# EAGLE design main (EAGLE 8.4.0)
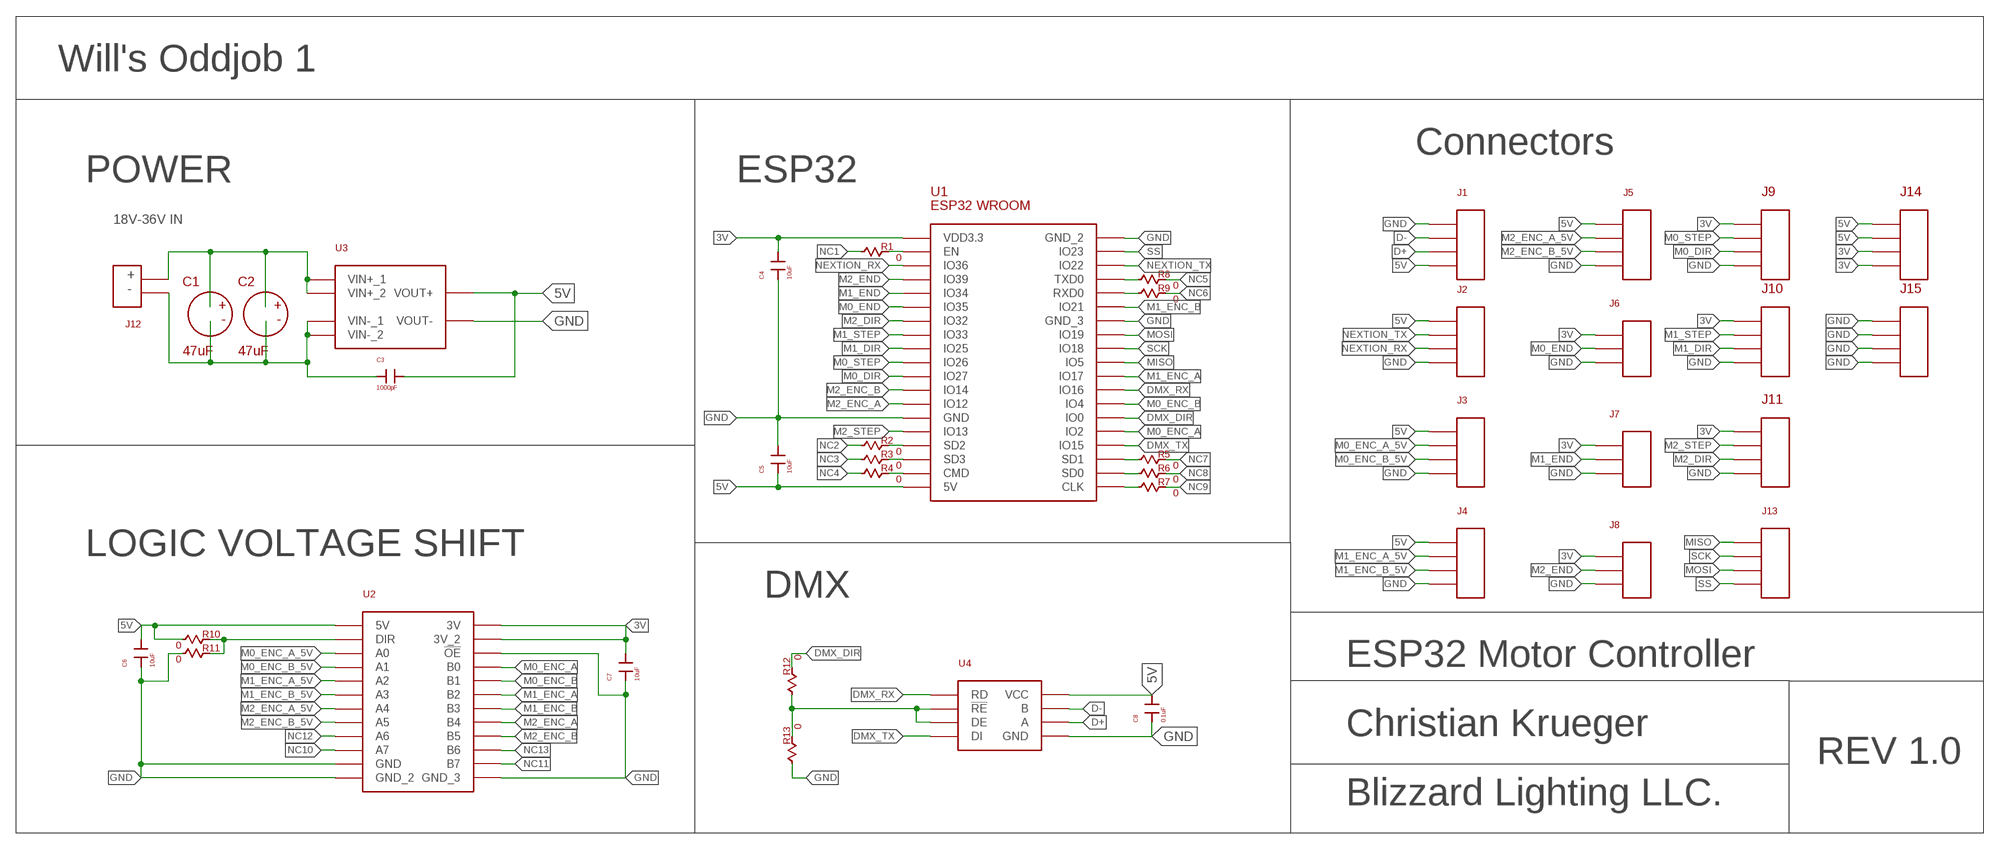
[diagram p0: schematic, sheet 1]

## Parts
C1  47uF  TH_CAP_DEV  [TH_CAP_PKG]
C2  47uF  TH_CAP_DEV  [TH_CAP_PKG]
C3  1000pF  1808_CAP_DEV  [1808_PKG]
C4  10uF  0805_CAP_DEV  [0805_PKG]
C5  10uF  0805_CAP_DEV  [0805_PKG]
C6  10uF  0805_CAP_DEV  [0805_PKG]
C7  10uF  0805_CAP_DEV  [0805_PKG]
C8  0.1uF  0805_CAP_DEV  [0805_PKG]
J1  XH_4POS_DEV  [XH_4POS_PKG]
J2  XH_4POS_DEV  [XH_4POS_PKG]
J3  XH_4POS_DEV  [XH_4POS_PKG]
J4  XH_4POS_DEV  [XH_4POS_PKG]
J5  XH_4POS_DEV  [XH_4POS_PKG]
J6  XH_3POS_DEV  [XH_3POS_PKG]
J7  XH_3POS_DEV  [XH_3POS_PKG]
J8  XH_3POS_DEV  [XH_3POS_PKG]
J9  4_PIN_SCREW_3.5MM_DEV  [4_PIN_SCREW_3.5MM_PKG]
J10  4_PIN_SCREW_3.5MM_DEV  [4_PIN_SCREW_3.5MM_PKG]
J11  4_PIN_SCREW_3.5MM_DEV  [4_PIN_SCREW_3.5MM_PKG]
J12  2_PIN_SCREW_3.5MM_DEV  [2_PIN_SCREW_3.5MM_PKG]
J13  4_PIN_2.54MM_PKG  [4_PIN_2.54MM_PKG]
J14  4_PIN_SCREW_3.5MM_DEV  [4_PIN_SCREW_3.5MM_PKG]
J15  4_PIN_SCREW_3.5MM_DEV  [4_PIN_SCREW_3.5MM_PKG]
R1  0  0805_RES_DEV  [0805_PKG]
R2  0  0805_RES_DEV  [0805_PKG]
R3  0  0805_RES_DEV  [0805_PKG]
R4  0  0805_RES_DEV  [0805_PKG]
R5  0  0805_RES_DEV  [0805_PKG]
R6  0  0805_RES_DEV  [0805_PKG]
R7  0  0805_RES_DEV  [0805_PKG]
R8  0  0805_RES_DEV  [0805_PKG]
R9  0  0805_RES_DEV  [0805_PKG]
R10  0  0805_RES_DEV  [0805_PKG]
R11  0  0805_RES_DEV  [0805_PKG]
R12  0  0805_RES_DEV  [0805_PKG]
R13  0  0805_RES_DEV  [0805_PKG]
U1  ESP32_WROOM_BREAKOUT_DEV  [ESP_WROOM_BREAKOUT_PKG]
U2  8_CHANNEL_LEVEL_SHIFTER  [8_LEVEL_SHIFTER_PKG]
U3  5V_SWITCHING_POWER_DEV  [5V_SWITCHING_POWER_PKG]
U4  MAX_485_DEV  [MAX_485_PKG]

## Nets
3V: C4.P$2 C7.P$2 J6.P$1 J7.P$1 J8.P$1 J9.1 J10.1 J11.1 J14.3 J14.4 U1.VDD3.3 U2.3V U2.3V_2
5V: C3.P$2 C5.P$1 C6.P$2 C8.P$2 J1.P$4 J2.P$1 J3.P$1 J4.P$1 J5.P$1 J14.1 J14.2 R10.P$1 U1.5V U2.5V U3.VOUT+ U4.P$8(VCC)
D+: J1.P$3 U4.P$6(A)
D-: J1.P$2 U4.P$7(B)
DMX_DIR: R12.P$2 U1.IO0
DMX_RX: U1.IO16 U4.P$1(RD)
DMX_TX: U1.IO15 U4.P$4(DI)
GND: C4.P$1 C5.P$2 C6.P$1 C7.P$1 C8.P$1 J1.P$1 J2.P$4 J3.P$4 J4.P$4 J5.P$4 J6.P$3 J7.P$3 J8.P$3 J9.4 J10.4 J11.4 J15.1 J15.2 J15.3 J15.4 R11.P$1 R13.P$1 U1.GND U1.GND_2 U1.GND_3 U2.!OE U2.GND U2.GND_2 U2.GND_3 U3.VOUT- U4.P$5(GND)
M0_DIR: J9.3 U1.IO27
M0_ENC_A: U1.IO2 U2.B0
M0_ENC_A_5V: J3.P$2 U2.A0
M0_ENC_B: U1.IO4 U2.B1
M0_ENC_B_5V: J3.P$3 U2.A1
M0_END: J6.P$2 U1.IO35
M0_STEP: J9.2 U1.IO26
M1_DIR: J10.3 U1.IO25
M1_ENC_A: U1.IO17 U2.B2
M1_ENC_A_5V: J4.P$2 U2.A2
M1_ENC_B: U1.IO21 U2.B3
M1_ENC_B_5V: J4.P$3 U2.A3
M1_END: J7.P$2 U1.IO34
M1_STEP: J10.2 U1.IO33
M2_DIR: J11.3 U1.IO32
M2_ENC_A: U1.IO12 U2.B4
M2_ENC_A_5V: J5.P$2 U2.A4
M2_ENC_B: U1.IO14 U2.B5
M2_ENC_B_5V: J5.P$3 U2.A5
M2_END: J8.P$2 U1.IO39
M2_STEP: J11.2 U1.IO13
MISO: J13.1 U1.IO5
MOSI: J13.3 U1.IO19
N$1: C1.P$1 C2.P$1 J12.P$2 U3.VIN+_1 U3.VIN+_2
N$2: C1.P$2 C2.P$2 C3.P$1 J12.P$1 U3.VIN-_1 U3.VIN-_2
N$3: R1.P$2 U1.EN
N$4: R12.P$1 R13.P$2 U4.P$2(!RE) U4.P$3(DE)
N$5: R2.P$2 U1.SD2
N$6: R3.P$2 U1.SD3
N$7: R4.P$2 U1.CMD
N$9: R10.P$2 R11.P$2 U2.DIR
N$11: R7.P$1 U1.CLK
N$12: R6.P$1 U1.SD0
N$13: R5.P$1 U1.SD1
N$17: R8.P$1 U1.TXD0
N$18: R9.P$1 U1.RXD0
NC1: R1.P$1
NC2: R2.P$1
NC3: R3.P$1
NC4: R4.P$1
NC5: R8.P$2
NC6: R9.P$2
NC7: R5.P$2
NC8: R6.P$2
NC9: R7.P$2
NC10: U2.A7
NC11: U2.B7
NC12: U2.A6
NC13: U2.B6
NEXTION_RX: J2.P$3 U1.IO36
NEXTION_TX: J2.P$2 U1.IO22
SCK: J13.2 U1.IO18
SS: J13.4 U1.IO23

## Notes on the sheet
- Will's Oddjob 1
- Connectors
- POWER | ESP32
- 18V-36V IN
- +
- -
- LOGIC VOLTAGE SHIFT
- DMX
- ESP32 Motor Controller
- Christian Krueger
- REV 1.0
- Blizzard Lighting LLC.

## Library data of the parts
C1 C2 = blizzard_common_1:TH_CAP_DEV
C3 = blizzard_common_1:1808_CAP_DEV
C4-C8 = blizzard_common_1:0805_CAP_DEV
J1-J5 = blizzard_common_1:XH_4POS_DEV
J6-J8 = blizzard_common_1:XH_3POS_DEV
J9-J11 J14 J15 = blizzard_common_0:4_PIN_SCREW_3.5MM_DEV
J12 = blizzard_common_0:2_PIN_SCREW_3.5MM_DEV
J13 = blizzard_common_0:4_PIN_2.54MM_PKG
R1-R13 = blizzard_common_1:0805_RES_DEV
U1 = blizzard_common_0:ESP32_WROOM_BREAKOUT_DEV: ESP32 WROOM Breakout
U2 = blizzard_common_0:8_CHANNEL_LEVEL_SHIFTER
U3 = blizzard_common_0:5V_SWITCHING_POWER_DEV
U4 = blizzard_board:MAX_485_DEV: MAX 485

## Board
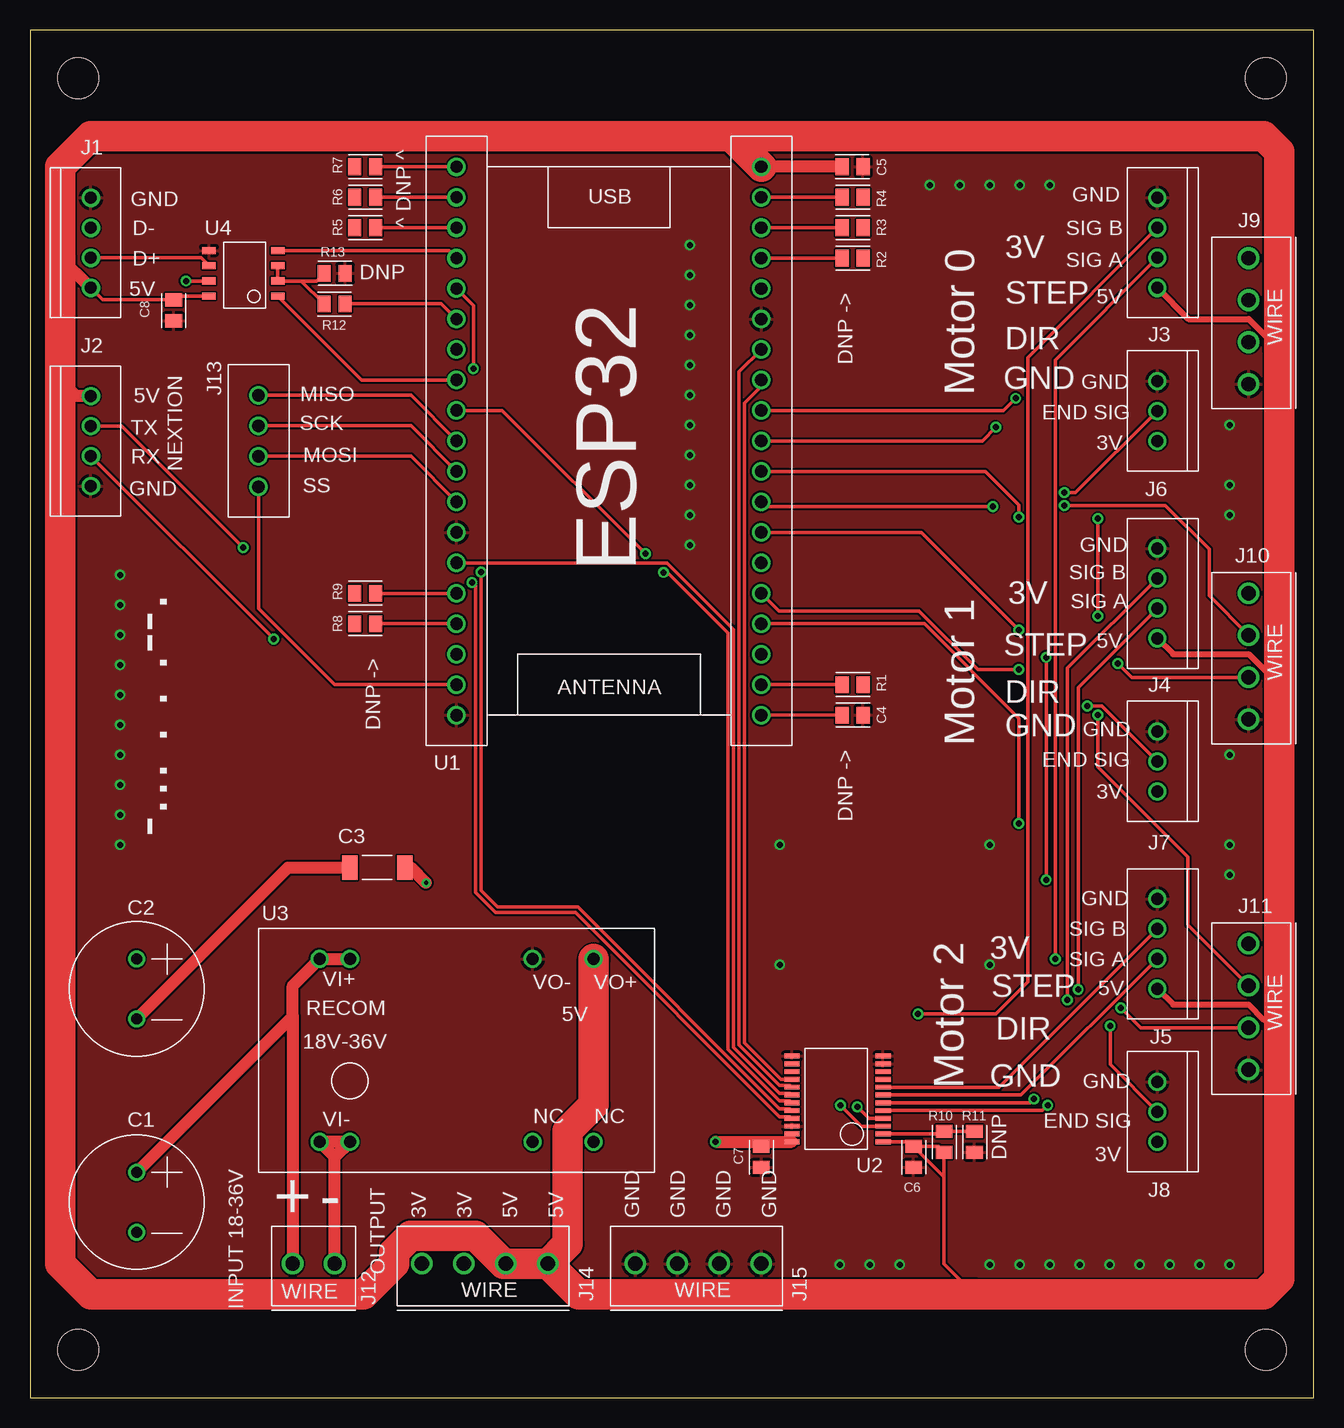
[diagram p1: board, top side]
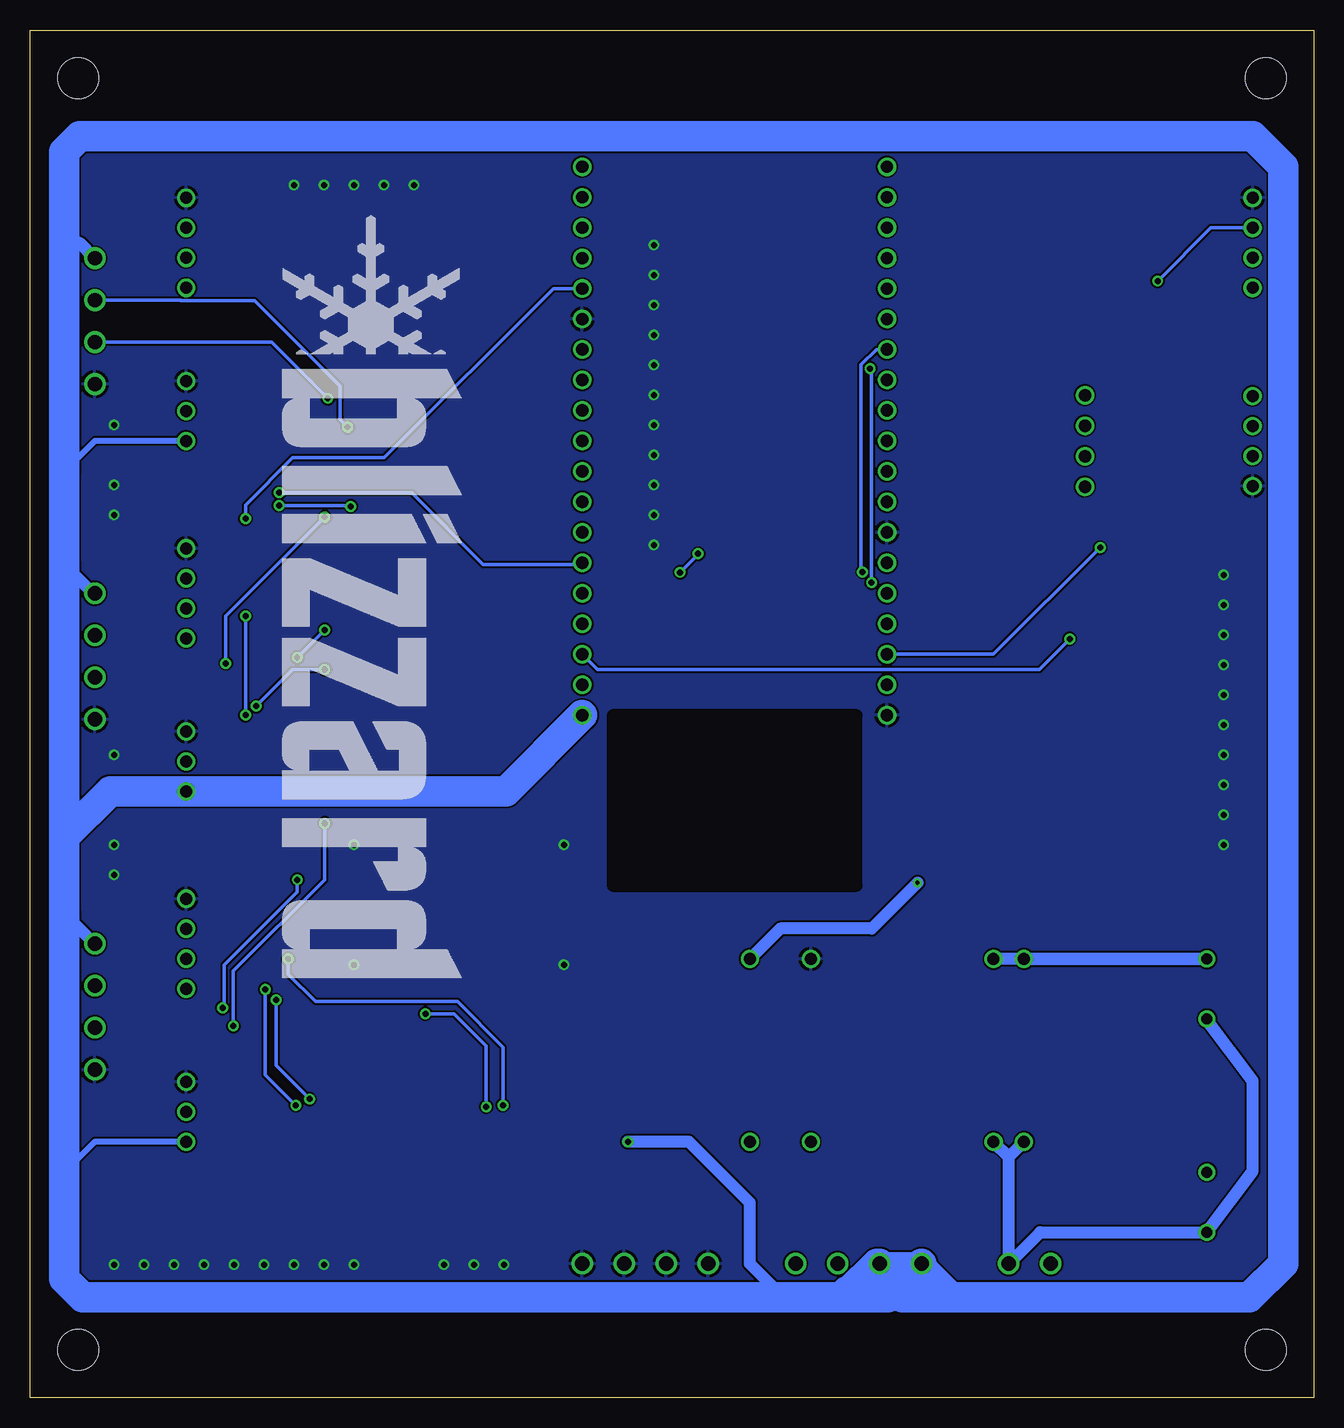
[diagram p2: board, bottom side, seen from below]

Size 107 x 114 mm. Coordinates in mm from the lower left corner, seen from the top.
Outline: 0,0 107,0 107,114 0,114 0,0
Copper layers (1*16): Top 0.035mm / dielectric 1.5mm / Bottom 0.035mm
Design rules "default": minimum track width 6mil, minimum drill 0.35mm, track to track 6mil, track to pad 6mil, pad to pad 6mil, via to via 6mil, smd to smd 6mil, copper to edge 40mil, drill to drill 6mil, minimum pad ring 10mil, minimum via ring 8mil, stop-mask expansion 4mil, vias tented up to drill 0mil, thermal gap 10mil
Holes 3.4 mm at 4,4 103,4 103,110 4,110

### Footprints (pad centres in the part's own frame; a part is rotated, then mirrored left to right if it is on the bottom)
TH_CAP_PKG = drill 0.9: P$1 0,0; P$2 0,-5
1808_PKG = smd 1.3 x 2.05: P$1 0,0; P$2 4.57,0
0805_PKG = smd 1.1 x 1.4: P$1 -0.875,0; P$2 0.875,0
XH_4POS_PKG = drill 1: P$1 -3.75,0; P$2 -1.25,0; P$3 1.25,0; P$4 3.75,0
XH_3POS_PKG = drill 1: P$1 0,0; P$2 2.5,0; P$3 5,0
4_PIN_SCREW_3.5MM_PKG = drill 1.2: 1 0,0; 2 3.5,0; 3 7,0; 4 10.5,0
2_PIN_SCREW_3.5MM_PKG = drill 1.2: P$1 0,0; P$2 3.5,0
4_PIN_2.54MM_PKG = drill 1.03: 1 0,0; 2 2.54,0; 3 5.08,0; 4 7.62,0
ESP_WROOM_BREAKOUT_PKG = drill 1.03: 5V 0,-45.72; CLK 25.4,-45.72; CMD 0,-43.18; EN 0,-2.54; GND 0,-33.02; GND_2 25.4,0; GND_3 25.4,-15.24; IO0 25.4,-33.02; IO2 25.4,-35.56; IO4 25.4,-30.48; IO5 25.4,-22.86; IO12 0,-30.48; IO13 0,-35.56; IO14 0,-27.94; IO15 25.4,-38.1; IO16 25.4,-27.94; IO17 25.4,-25.4; IO18 25.4,-20.32; IO19 25.4,-17.78; IO21 25.4,-12.7; IO22 25.4,-5.08; IO23 25.4,-2.54; IO25 0,-20.32; IO26 0,-22.86; IO27 0,-25.4; IO32 0,-15.24; IO33 0,-17.78; IO34 0,-10.16; IO35 0,-12.7; IO36 0,-5.08; IO39 0,-7.62; RXD0 25.4,-10.16; SD0 25.4,-43.18; SD1 25.4,-40.64; SD2 0,-38.1; SD3 0,-40.64; TXD0 25.4,-7.62; VDD3.3 0,0
8_LEVEL_SHIFTER_PKG = smd 1.27 x 0.4: 3V 7.6,0; 3V_2 7.6,-0.65; 5V 0,0; !OE 7.6,-1.3; A0 0,-1.3; A1 0,-1.95; A2 0,-2.6; A3 0,-3.25; A4 0,-3.9; A5 0,-4.55; A6 0,-5.2; A7 0,-5.85; B0 7.6,-1.95; B1 7.6,-2.6; B2 7.6,-3.25; B3 7.6,-3.9; B4 7.6,-4.55; B5 7.6,-5.2; B6 7.6,-5.85; B7 7.6,-6.5; DIR 0,-0.65; GND 0,-6.5; GND_2 0,-7.15; GND_3 7.6,-7.15
5V_SWITCHING_POWER_PKG = drill 1: NC_1 17.78,-15.24; NC_2 22.86,-15.24; VIN+_1 0,0; VIN+_2 2.54,0; VIN-_1 0,-15.24; VIN-_2 2.54,-15.24; VOUT+ 22.86,0; VOUT- 17.78,0
MAX_485_PKG = smd 0.6 x 1.15: P$1 -1.905,-2.883; P$2 -0.635,-2.883; P$3 0.635,-2.883; P$4 1.905,-2.883; P$5 1.905,2.857; P$6 0.635,2.857; P$7 -0.635,2.857; P$8 -1.905,2.857

### Placement (x,y rotation side)
C1  8.89,18.78 0 top
C2  8.89,36.56 0 top
C3  26.67,44.18 0 top
C4  68.58,56.88 180 top
C5  68.58,102.6 0 top
C6  73.66,20.05 90 top
C7  60.96,20.05 90 top
C8  11.97,90.63 90 top
J1  5.08,96.25 270 top
J2  5.08,79.74 270 top
J3  93.98,96.25 90 top
J4  93.98,67.04 90 top
J5  93.98,37.83 90 top
J6  93.98,79.74 90 top
J7  93.98,50.53 90 top
J8  93.98,21.32 90 top
J9  101.6,94.98 270 top
J10  101.6,67.04 270 top
J11  101.6,37.83 270 top
J12  25.4,11.16 180 top
J13  19.05,83.55 270 top
J14  43.18,11.16 180 top
J15  60.96,11.16 180 top
R1  68.58,59.42 180 top
R2  68.58,94.98 180 top
R3  68.58,97.52 180 top
R4  68.58,100.06 180 top
R5  27.94,97.52 180 top
R6  27.94,100.06 180 top
R7  27.94,102.6 180 top
R8  27.94,64.5 180 top
R9  27.94,67.04 180 top
R10  76.2,21.32 90 top
R11  78.74,21.32 90 top
R12  25.4,91.17 0 top
R13  25.4,93.71 180 top
U1  60.96,56.88 180 top
U2  71.12,21.32 180 top
U3  24.13,36.56 0 top
U4  17.78,93.71 90 top

### Tracks (layer width: path | path; a pad name or v marks a point on that pad's centre or on a via)
3V  (via drill 0.5)
  Top 0.305: U2.3V_2 U2.3V 63.12,20.93 C7.P$2 | C4.P$2 U1.VDD3.3
  Top 1.016: v57.15,21.32 U2.3V
  Bottom 0.508: J6.P$1 101.6,79.74 104.14,77.2 | J7.P$1 101.6,50.53 104.14,47.99 104.14,46.72 | J8.P$1 101.6,21.32 104.14,18.78 104.14,17.51
  Bottom 1.016: J14.3 36.51,10.84 38.72,8.62 44.45,8.62 46.99,11.16 46.99,16.24 52.07,21.32 v57.15,21.32 | J9.1 102.87,96.25 104.14,96.25 | J11.1 104.14,40.37 | J10.1 101.73,67.04 104.14,69.45
  Bottom 2.54: J14.4 33.01,10.84 36.51,10.84 | J14.4 35.47,8.37 39.37,8.37 | 39.37,8.37 102.62,8.37 104.14,9.89 104.14,17.51 104.14,40.37 104.14,46.72 | 104.14,46.72 104.14,69.45 104.14,77.2 104.14,96.25 104.14,103.87 102.87,105.14 5.08,105.14 2.54,102.6 2.54,11.16 5.33,8.37 34.29,8.37 | J14.4 32.68,10.82 30.48,8.62 33.64,8.62 J14.3 36.4,11.16 38.72,8.84 38.9,8.84 39.37,8.37 | U1.VDD3.3 67.31,50.53 100.33,50.53 104.14,46.72
5V  (via drill 0.35)
  Top 0.305: U4.P$8 12.27,91.81 C8.P$2 6.08,91.51 J1.P$4 | U2.5V 73.27,21.32 C6.P$2 | C6.P$2 75.72,20.93 R10.P$1 76.2,18.39 | C6.P$2 76.2,18.39 | 76.2,18.39 76.2,11.16 78.74,8.62
  Top 0.508: J5.P$1 95.31,32.75 101.6,32.75 102.87,31.48 104.14,31.48 | J4.P$1 95.31,61.96 101.6,61.96 104.14,59.42 | J3.P$1 96.58,89.9 101.6,89.9 104.14,87.36
  Top 1.016: v33.02,42.91 31.75,44.18 C3.P$2 | C5.P$1 U1.5V | J2.P$1 3.87,83.49 2.54,84.82 | J1.P$4 5.02,92.5 2.54,94.98
  Top 2.54: J14.1 J14.2 39.46,11.16 37.14,13.48 31.72,13.48 30.36,12.12 30.36,11.16 27.82,8.62 5.08,8.62 2.54,11.16 2.54,84.82 2.54,94.98 2.54,102.6 5.08,105.14 58.42,105.14 | 58.42,105.14 102.87,105.14 104.14,103.87 104.14,87.36 104.14,59.42 104.14,31.48 104.14,9.89 102.87,8.62 78.74,8.62 45.72,8.62 J14.1 | J14.1 44.81,12.79 44.81,22.22 46.99,24.4 U3.VOUT+ | U1.5V 58.42,105.14
  Bottom 1.016: U3.VOUT+ 44.45,39.1 36.83,39.1 v33.02,42.91
D+
  Top 0.305: U4.P$6 14.27,95 J1.P$3
D-  (via drill 0.5)
  Top 0.305: U4.P$7 v13,93.08
  Bottom 0.305: v13,93.08 8.58,97.5 J1.P$2
DMX_DIR
  Top 0.305: R12.P$2 34.29,91.17 U1.IO0
DMX_RX
  Top 0.305: U4.P$1 27.65,84.82 U1.IO16
DMX_TX
  Top 0.305: U4.P$4 34.92,95.62 U1.IO15
GND  (via drill 0.5)
  other vias: 7.5,46.08 7.5,48.58 7.5,51.08 7.5,53.58 7.5,56.08 7.5,58.58 7.5,61.08 7.5,63.58 7.5,66.08 7.5,68.58 55,96.08 55,93.58 55,91.08 55,88.58 55,86.08 55,83.58 55,81.08 55,78.58 55,76.08 55,73.58 55,71.08 75,101.08 77.5,101.08 80,101.08 82.5,101.08 85,101.08 100,11.08 97.5,11.08 95,11.08 92.5,11.08 90,11.08 87.5,11.08 85,11.08 82.5,11.08 80,11.08 72.5,11.08 70,11.08 67.5,11.08 100,73.58 100,76.08 100,81.08 100,53.58 100,46.08 100,43.58 62.5,46.08 80,46.08 80,36.08 62.5,36.08
  pour Top: 0,0 0.23,104.4 113.26,104.4 113.03,81.28 113.03,0
  pour Bottom: 0,0 108.5,-1.19 108.5,99.14 106.92,104.79 0.44,104.22
  cutout Top: 38.1,56.88 58.42,56.88 58.42,42.66 38.1,42.66
  cutout Bottom: 38.1,56.88 58.42,56.88 58.42,42.66 38.1,42.66
M0_DIR  (via drill 0.5)
  Top 0.305: U1.IO27 81.15,82.28 v82.17,83.3
  Bottom 0.305: v82.17,83.3 86.85,87.98 J9.3
M0_ENC_A  (via drill 0.5)
  Top 0.305: U2.B0 63.38,23.42 62.49,23.42 45.48,40.42 38.8,40.42 37.13,42.09 37.13,67.63 v36.83,67.93 | v36.96,85.78 36.96,91.04 U1.IO2
  Bottom 0.305: v36.83,67.93 36.83,85.65 v36.96,85.78
M0_ENC_A_5V  (via drill 0.5)
  Top 0.305: U2.A0 69.31,22.62 v67.56,24.37 | v85.47,36.56 85.47,86.49 J3.P$2
  Bottom 0.305: v67.56,24.37 67.56,29.2 71.37,33.01 83.19,33.01 85.47,35.29 v85.47,36.56
M0_ENC_B  (via drill 0.5)
  Top 0.305: U2.B1 63.38,24.07 62.49,24.07 45.67,40.88 38.99,40.88 37.59,42.28 v37.59,68.82
  Bottom 0.305: v37.59,68.82 37.72,68.95 37.72,86.09 36.45,87.36 U1.IO4
M0_ENC_B_5V  (via drill 0.5)
  Top 0.305: U2.A1 69.93,23.27 v68.96,24.24 | v74.04,31.99 80.52,31.99 83.19,34.66 83.19,86.71 J3.P$3
  Bottom 0.305: v68.96,24.24 68.96,29.32 71.63,31.99 v74.04,31.99
M0_END  (via drill 0.5)
  Top 0.305: J6.P$2 87.16,75.42 v86.23,75.42
  Bottom 0.305: U1.IO35 61.09,69.45 69.22,69.45 75.18,75.42 v86.23,75.42
M0_STEP  (via drill 0.5)
  Top 0.305: U1.IO26 79.38,79.74 v80.52,80.88
  Bottom 0.305: v80.52,80.88 81.15,81.52 81.15,84.31 88.28,91.44 94.42,91.44 94.46,91.48 J9.2
M1_DIR  (via drill 0.5)
  Top 0.305: J10.3 91.84,60.04 v90.68,61.2 | v82.43,73.39 82.43,74.4 79.63,77.2 U1.IO25
  Bottom 0.305: v90.68,61.2 90.68,65.14 v82.43,73.39
M1_ENC_A  (via drill 0.5)
  Top 0.305: U2.B2 63.38,24.72 62.48,24.72 58.19,29.01 58.19,63.74 53.14,68.79 v52.8,68.79 | v51.31,70.34 39.37,82.28 U1.IO17
  Bottom 0.305: v52.8,68.79 51.31,70.29 v51.31,70.34
M1_ENC_A_5V  (via drill 0.5)
  Top 0.305: U2.A2 84.39,23.92 v84.84,24.37 | v87.38,34.02 87.38,59.19 J4.P$2
  Bottom 0.305: v84.84,24.37 87.38,26.91 v87.38,34.02
M1_ENC_B
  Top 0.305: U2.B3 63.38,25.37 62.48,25.37 58.65,29.2 58.65,64.02 53.09,69.58 U1.IO21
M1_ENC_B_5V  (via drill 0.5)
  Top 0.305: U2.A3 83.39,24.57 v83.69,24.88 | v86.49,33.13 86.49,60.8 J4.P$3
  Bottom 0.305: v83.69,24.88 86.49,27.67 v86.49,33.13
M1_END  (via drill 0.5)
  Top 0.305: J7.P$2 89.37,57.64 v88.14,57.64 | v82.43,60.69 79.01,60.69 74.12,65.58 62.42,65.58 U1.IO34
  Bottom 0.305: v88.14,57.64 85.09,60.69 v82.43,60.69
M1_STEP  (via drill 0.5)
  Top 0.305: J10.2 98.3,66.84 98.3,70.72 94.66,74.36 v86.23,74.36 | v80.26,74.28 61.34,74.28 U1.IO33
  Bottom 0.305: v86.23,74.36 80.35,74.36 v80.26,74.28
M2_DIR  (via drill 0.5)
  Top 0.305: J11.3 92.6,30.83 v90.95,32.48 | v84.71,43.16 v84.71,61.71 | v82.43,63.99 74.3,72.12 U1.IO32
  Bottom 0.305: v90.95,32.48 90.81,32.62 90.81,36.05 84.71,42.15 v84.71,43.16 | v84.71,61.71 v82.43,63.99
M2_ENC_A
  Top 0.305: U2.B4 63.38,26.02 62.48,26.02 59.11,29.39 59.11,85.51 U1.IO12
M2_ENC_A_5V
  Top 0.305: U2.A4 82.62,25.22 J5.P$2
M2_ENC_B
  Top 0.305: U2.B5 62.62,26.52 59.56,29.58 59.56,82.92 60.96,84.31 U1.IO14
M2_ENC_B_5V
  Top 0.305: U2.A5 80.77,25.87 J5.P$3
M2_END  (via drill 0.5)
  Top 0.305: J8.P$2 90.04,27.76 v90.04,30.97 | v82.43,47.86 82.43,56.62 74.55,64.5 U1.IO39
  Bottom 0.305: v90.04,30.97 90.04,35.55 82.43,43.16 v82.43,47.86
M2_STEP  (via drill 0.5)
  Top 0.305: J11.2 96.52,39.41 96.52,45.07 89.03,52.56 v89.03,56.88 | v89.03,65.14 v89.03,73.26
  Bottom 0.305: v89.03,56.88 v89.03,65.14 | v89.03,73.26 89.03,74.41 85.09,78.34 77.47,78.34 63.37,92.44 U1.IO13
MISO
  Top 0.305: J13.1 31.75,83.55 U1.IO5
MOSI
  Top 0.305: J13.3 31.75,78.47 U1.IO19
N$1
  Top 1.016: 21.9,31.79 J12.P$2 | U3.VIN+_2 U3.VIN+_1 21.9,34.33 21.9,31.79 | C1.P$1 21.9,31.79
  Bottom 1.016: U3.VIN+_1 C2.P$1 U3.VIN+_2
N$2
  Top 1.016: 25.4,20.05 U3.VIN-_1 U3.VIN-_2 25.4,20.05 | J12.P$1 25.4,20.05 | C2.P$2 21.51,44.18 C3.P$1
  Bottom 1.016: U3.VIN-_2 25.4,20.05 | 25.4,20.05 J12.P$1 22.78,13.78 C1.P$2 5.08,18.86 5.08,26.4 8.89,31.48 C2.P$2 | 25.4,20.05 U3.VIN-_1
N$3
  Top 0.305: R1.P$2 U1.EN
N$4
  Top 0.305: U4.P$3 U4.P$2 | U4.P$2 23.89,93.08 R13.P$2 | U4.P$2 22.62,93.08 R12.P$1
N$5
  Top 0.305: R2.P$2 U1.SD2
N$6
  Top 0.305: R3.P$2 U1.SD3
N$7
  Top 0.305: R4.P$2 U1.CMD
N$9
  Top 0.305: U2.DIR 75.97,21.97 R10.P$2 R11.P$2
N$11
  Top 0.305: R7.P$1 U1.CLK
N$12
  Top 0.305: R6.P$1 U1.SD0
N$13
  Top 0.305: R5.P$1 U1.SD1
N$17
  Top 0.305: R8.P$1 U1.TXD0
N$18
  Top 0.305: R9.P$1 U1.RXD0
NEXTION_RX  (via drill 0.5)
  Top 0.305: J2.P$3 20.32,63.25 v20.32,63.23
  Bottom 0.305: U1.IO36 59.69,60.69 22.86,60.69 v20.32,63.23
NEXTION_TX  (via drill 0.5)
  Top 0.305: J2.P$2 7.64,80.99 v17.78,70.85
  Bottom 0.305: v17.78,70.85 26.67,61.96 U1.IO22
SCK
  Top 0.305: J13.2 31.75,81.01 U1.IO18
SS
  Top 0.305: J13.4 19.05,65.77 25.4,59.42 U1.IO23

### Text on the board
tPlace: GND | GND | ^ DNP ^ | D- | SIG B | 3V | D+ | SIG A | DNP | 5V | STEP | 5V | DIR | DNP -> | Motor 0 | GND | GND | 5V | MISO | END SIG | SCK | TX | 3V | RX | MOSI | NEXTION | GND | SS | GND | SIG B | 3V | SIG A | STEP | 5V | DIR | DNP -> | GND | GND | Motor 1 | END SIG | 3V | DNP -> | -... . . .--. | GND | SIG B | 3V | SIG A | 5V | STEP | DIR | Motor 2 | GND | GND | END SIG | DNP | 3V | OUTPUT | + | - | 3V | 3V | 5V | 5V | GND | GND | GND | GND | INPUT 18-36V